# Altium schematic sheet PressureSwitch.SchDoc
size A4
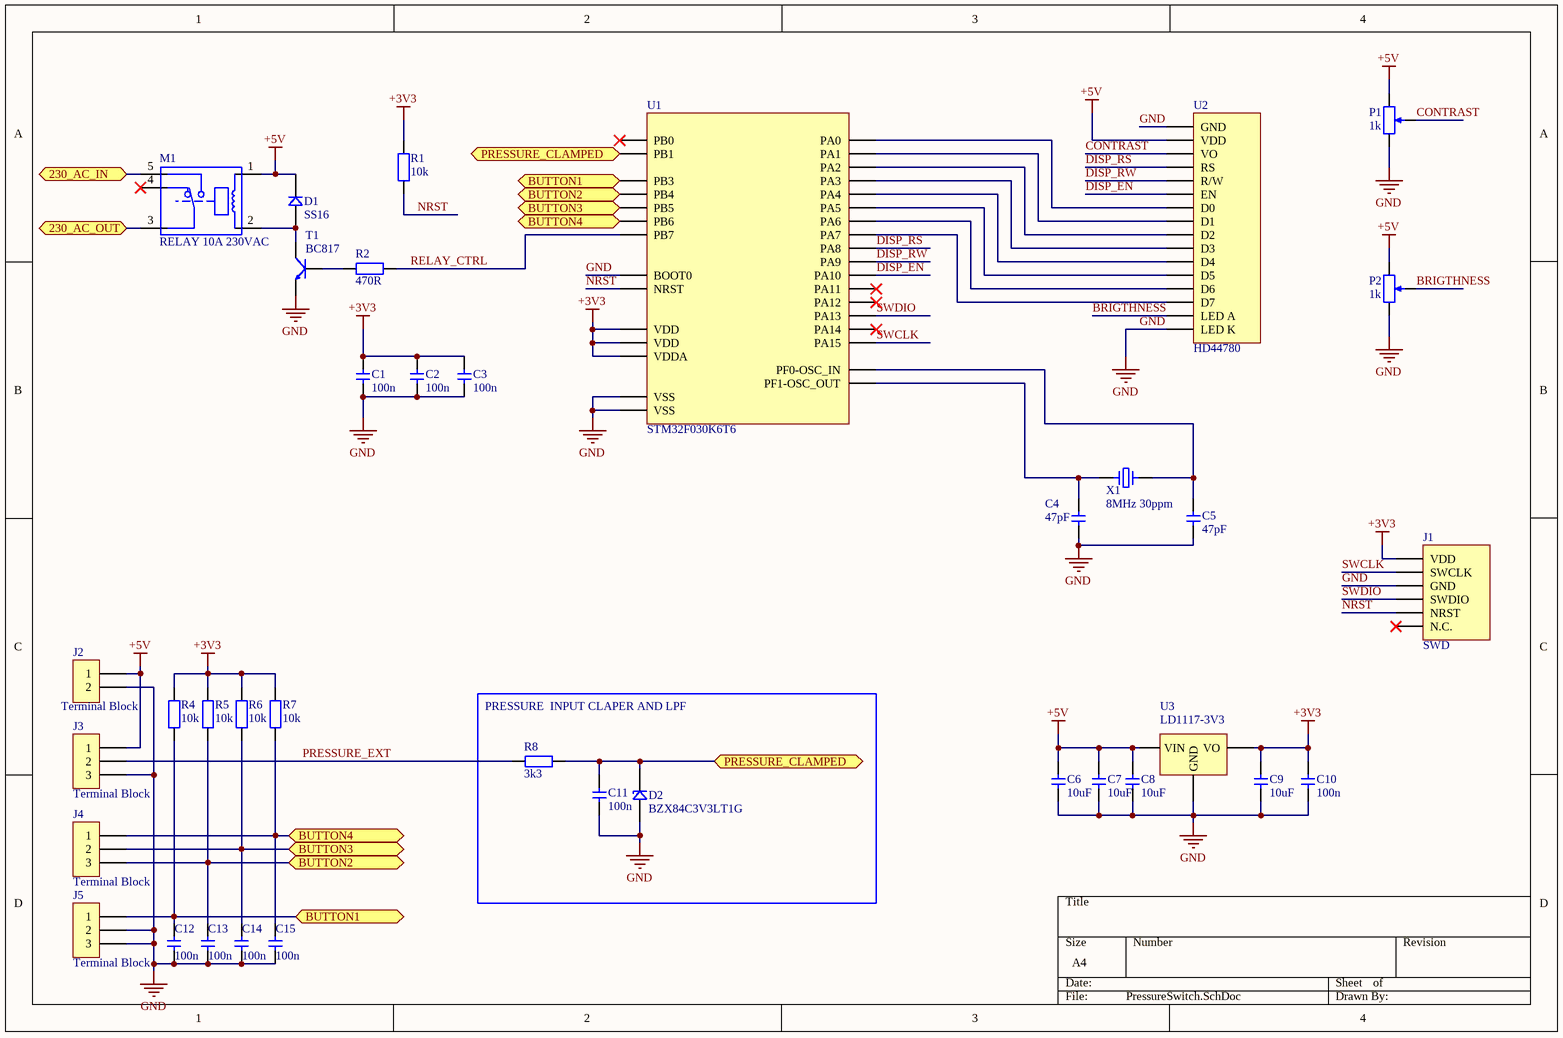
[diagram p0: PressureSwitch.SchDoc]

## Parts
C1  value 100n  [CAP_1206]  (hidden comment: Capacitor)
C2  value 100n  [CAP_1206]  (hidden comment: Capacitor)
C3  value 100n  [CAP_1206]  (hidden comment: Capacitor)
C4  value 47pF  [CAP_1206]  (hidden comment: Capacitor)
C5  value 47pF  [CAP_1206]  (hidden comment: Capacitor)
C6  10uF  [CAP_1206]
C7  10uF  [CAP_1206]
C8  10uF  [CAP_1206]
C9  10uF  [CAP_1206]
C10  value 100n  [CAP_1206]  (hidden comment: Capacitor)
C11  value 100n  [CAP_1206]  (hidden comment: Capacitor)
C12  value 100n  [CAP_1206]  (hidden comment: Capacitor)
C13  value 100n  [CAP_1206]  (hidden comment: Capacitor)
C14  value 100n  [CAP_1206]  (hidden comment: Capacitor)
C15  value 100n  [CAP_1206]  (hidden comment: Capacitor)
D1  SS16  [DO-214AC]
D2  BZX84C3V3LT1G  [SOT23-3]
J1  SWD  [PIN_HEADER_6P]
J2  Terminal Block  [TERMINAL_BLOCK_2P]
J3  Terminal Block  [TERMINAL_BLOCK_3P]
J4  Terminal Block  [TERMINAL_BLOCK_3P]
J5  Terminal Block  [TERMINAL_BLOCK_3P]
M1  RELAY 10A 230VAC  [Relay_10A]
P1  value 1k  [SMD_TRIM_POT]  (hidden comment: Resistor)
P2  value 1k  [SMD_TRIM_POT]  (hidden comment: Resistor)
R1  value 10k  [RES_1206]  (hidden comment: Resistor)
R2  value 470R  [RES_1206]  (hidden comment: Resistor)
R4  value 10k  [RES_1206]  (hidden comment: Resistor)
R5  value 10k  [RES_1206]  (hidden comment: Resistor)
R6  value 10k  [RES_1206]  (hidden comment: Resistor)
R7  value 10k  [RES_1206]  (hidden comment: Resistor)
R8  3k3  [RES_1206]
T1  BC817  [SOT23-3]
U1  STM32F030K6T6  [LQFP32]
U2  HD44780  [SOCKET_HEADER_16P]
U3  LD1117-3V3  [SOT223-3]
X1  8MHz 30ppm  [HC49]

## Blocks framed on the sheet
PRESSURE  INPUT CLAPER AND LPF: C11 D2 R8

## Ports
230_AC_IN, 230_AC_OUT, BUTTON1, BUTTON2, BUTTON3, BUTTON4, PRESSURE_CLAMPED

## Nets
+3V3: C1.2 C2.2 C3.2 C9.2 C10.2 J1.1(VDD) R1.2 R4.2 R5.2 R6.2 R7.2 U1.1(VDD) U1.5(VDDA) U1.17(VDD) U3.2(VO)
+5V: C6.2 C7.2 C8.2 D1.2 J2.1 J3.1 M1.1 P1.1 P2.1 U2.2(VDD) U3.3(VIN)
GND: C1.1 C2.1 C3.1 C4.1 C5.1 C6.1 C7.1 C8.1 C9.1 C10.1 C11.1 C12.1 C13.1 C14.1 C15.1 D2.1 J1.3(GND) J2.2 J3.3 J5.2 J5.3 P1.2 P2.2 T1.2(E) U1.16(VSS) U1.31(BOOT0) U1.32(VSS) U2.1(GND) U2.16(LED_K) U3.1(GND)
230_AC_IN: M1.5 ; port 230_AC_IN
230_AC_OUT: M1.3 ; port 230_AC_OUT
BRIGTHNESS: P2.3 U2.15(LED_A)
BUTTON1: C12.2 J5.1 R4.1 U1.26(PB3) ; port BUTTON1
BUTTON2: C13.2 J4.3 R5.1 U1.27(PB4) ; port BUTTON2
BUTTON3: C14.2 J4.2 R6.1 U1.28(PB5) ; port BUTTON3
BUTTON4: C15.2 J4.1 R7.1 U1.29(PB6) ; port BUTTON4
CONTRAST: P1.3 U2.3(VO)
DISP_EN: U1.20(PA10) U2.6(EN)
DISP_RS: U1.18(PA8) U2.4(RS)
DISP_RW: U1.19(PA9) U2.5(R/W)
NRST: J1.5(NRST) R1.1 U1.4(NRST)
PRESSURE_CLAMPED: C11.2 D2.3 R8.2 U1.15(PB1) ; port PRESSURE_CLAMPED
PRESSURE_EXT: J3.2 R8.1
RELAY_CTRL: R2.2 U1.30(PB7)
SWCLK: J1.2(SWCLK) U1.25(PA15)
SWDIO: J1.4(SWDIO) U1.23(PA13)
NetC4_2: C4.2 U1.3(PF1-OSC_OUT) X1.2
NetC5_2: C5.2 U1.2(PF0-OSC_IN) X1.1
NetD1_1: D1.1 M1.2 T1.3(C)
NetR2_1: R2.1 T1.1(B)
NetU1_6: U1.6(PA0) U2.7(D0)
NetU1_7: U1.7(PA1) U2.8(D1)
NetU1_8: U1.8(PA2) U2.9(D2)
NetU1_9: U1.9(PA3) U2.10(D3)
NetU1_10: U1.10(PA4) U2.11(D4)
NetU1_11: U1.11(PA5) U2.12(D5)
NetU1_12: U1.12(PA6) U2.13(D6)
NetU1_13: U1.13(PA7) U2.14(D7)

Not connected (* = marked no-connect by the designer): J1 6(N.C.)*; M1 4*; U1 14(PB0)* 21(PA11)* 22(PA12)* 24(PA14)*

## Library data of the parts
C1-C3 C10-C15 = 100n 50V 1206: 1206  100n 50V Capacitor; Tolerance: %; Voltage: 50V
C4 C5 = 47pF 50V 1206_1: 1206  47pF 50V Capacitor; Tolerance: %; Voltage: 50V
C6-C9 = 10uF: 10uF 5% Capacitor; Tolerance: %; Voltage: V; Value: 10uF
D1 = SS16: RECTIFIER 1A 60V
D2 = BZX84C3V3LT1G: 3V3 ZENER DIODE 225 mW SOT−23
J1 = SWD: STM32 SWD CONNECTOR
J2 = Terminal Block 2P: 5.08mm Terminal Blocks 2P
J3-J5 = Terminal Block 3P: 5.08mm Terminal Blocks 3P
M1 = RELAY 5V 10A/230VAC G6RN: MECH 5V 1xMORSE 10A/250AC S7001E5W 5DC
P1 P2 = 1k_TRIMPOT: Trimmer Pot 1k; Tolerance: 5%; Power: W
R1 R4-R7 = 10k: 1206 10k 5% Resistor; Power: 0.025W; Tolerance: 5%
R2 = 470R: 1206  470R 5% Resistor; Power: W; Tolerance: 5%
R8 = 3k3: 1206  3k3 5% Resistor; Power: W; Tolerance: 5%; Value: 3k3
T1 = BC817: BC817 NPN-UNI 45V 0.5A 0.25W 200MHz SOT-23; Ic: 500mA; Vrev: 45V; Power: 0.25W
U1 = STM32F030K6T6: Value-line ARM 32bit MCU with 32k Flash
U2 = HD44780: 16x2 CHARACTER DISPLAY
U3 = LD1117-3V3: 3.3V low drop positive voltage regulator
X1 = XTAL_8MHZ: 8.000MHz QUARZ HC49 30ppm 20pF LOW PROFILE